# Altium schematic sheet ProtectionChannelD.SchDoc
size 420 x 297 mm; Address1: Address1; Address2: Address2; Address3: Address3; Address4: Address4; DocumentNumber: АБВГ.123456.001 Э3; SheetNumber: 5; SheetTotal: 7; Scale: 1:1; DocumentType: Схема электрическая принципиальная; FirstReferrence: АБВГ.123456.001
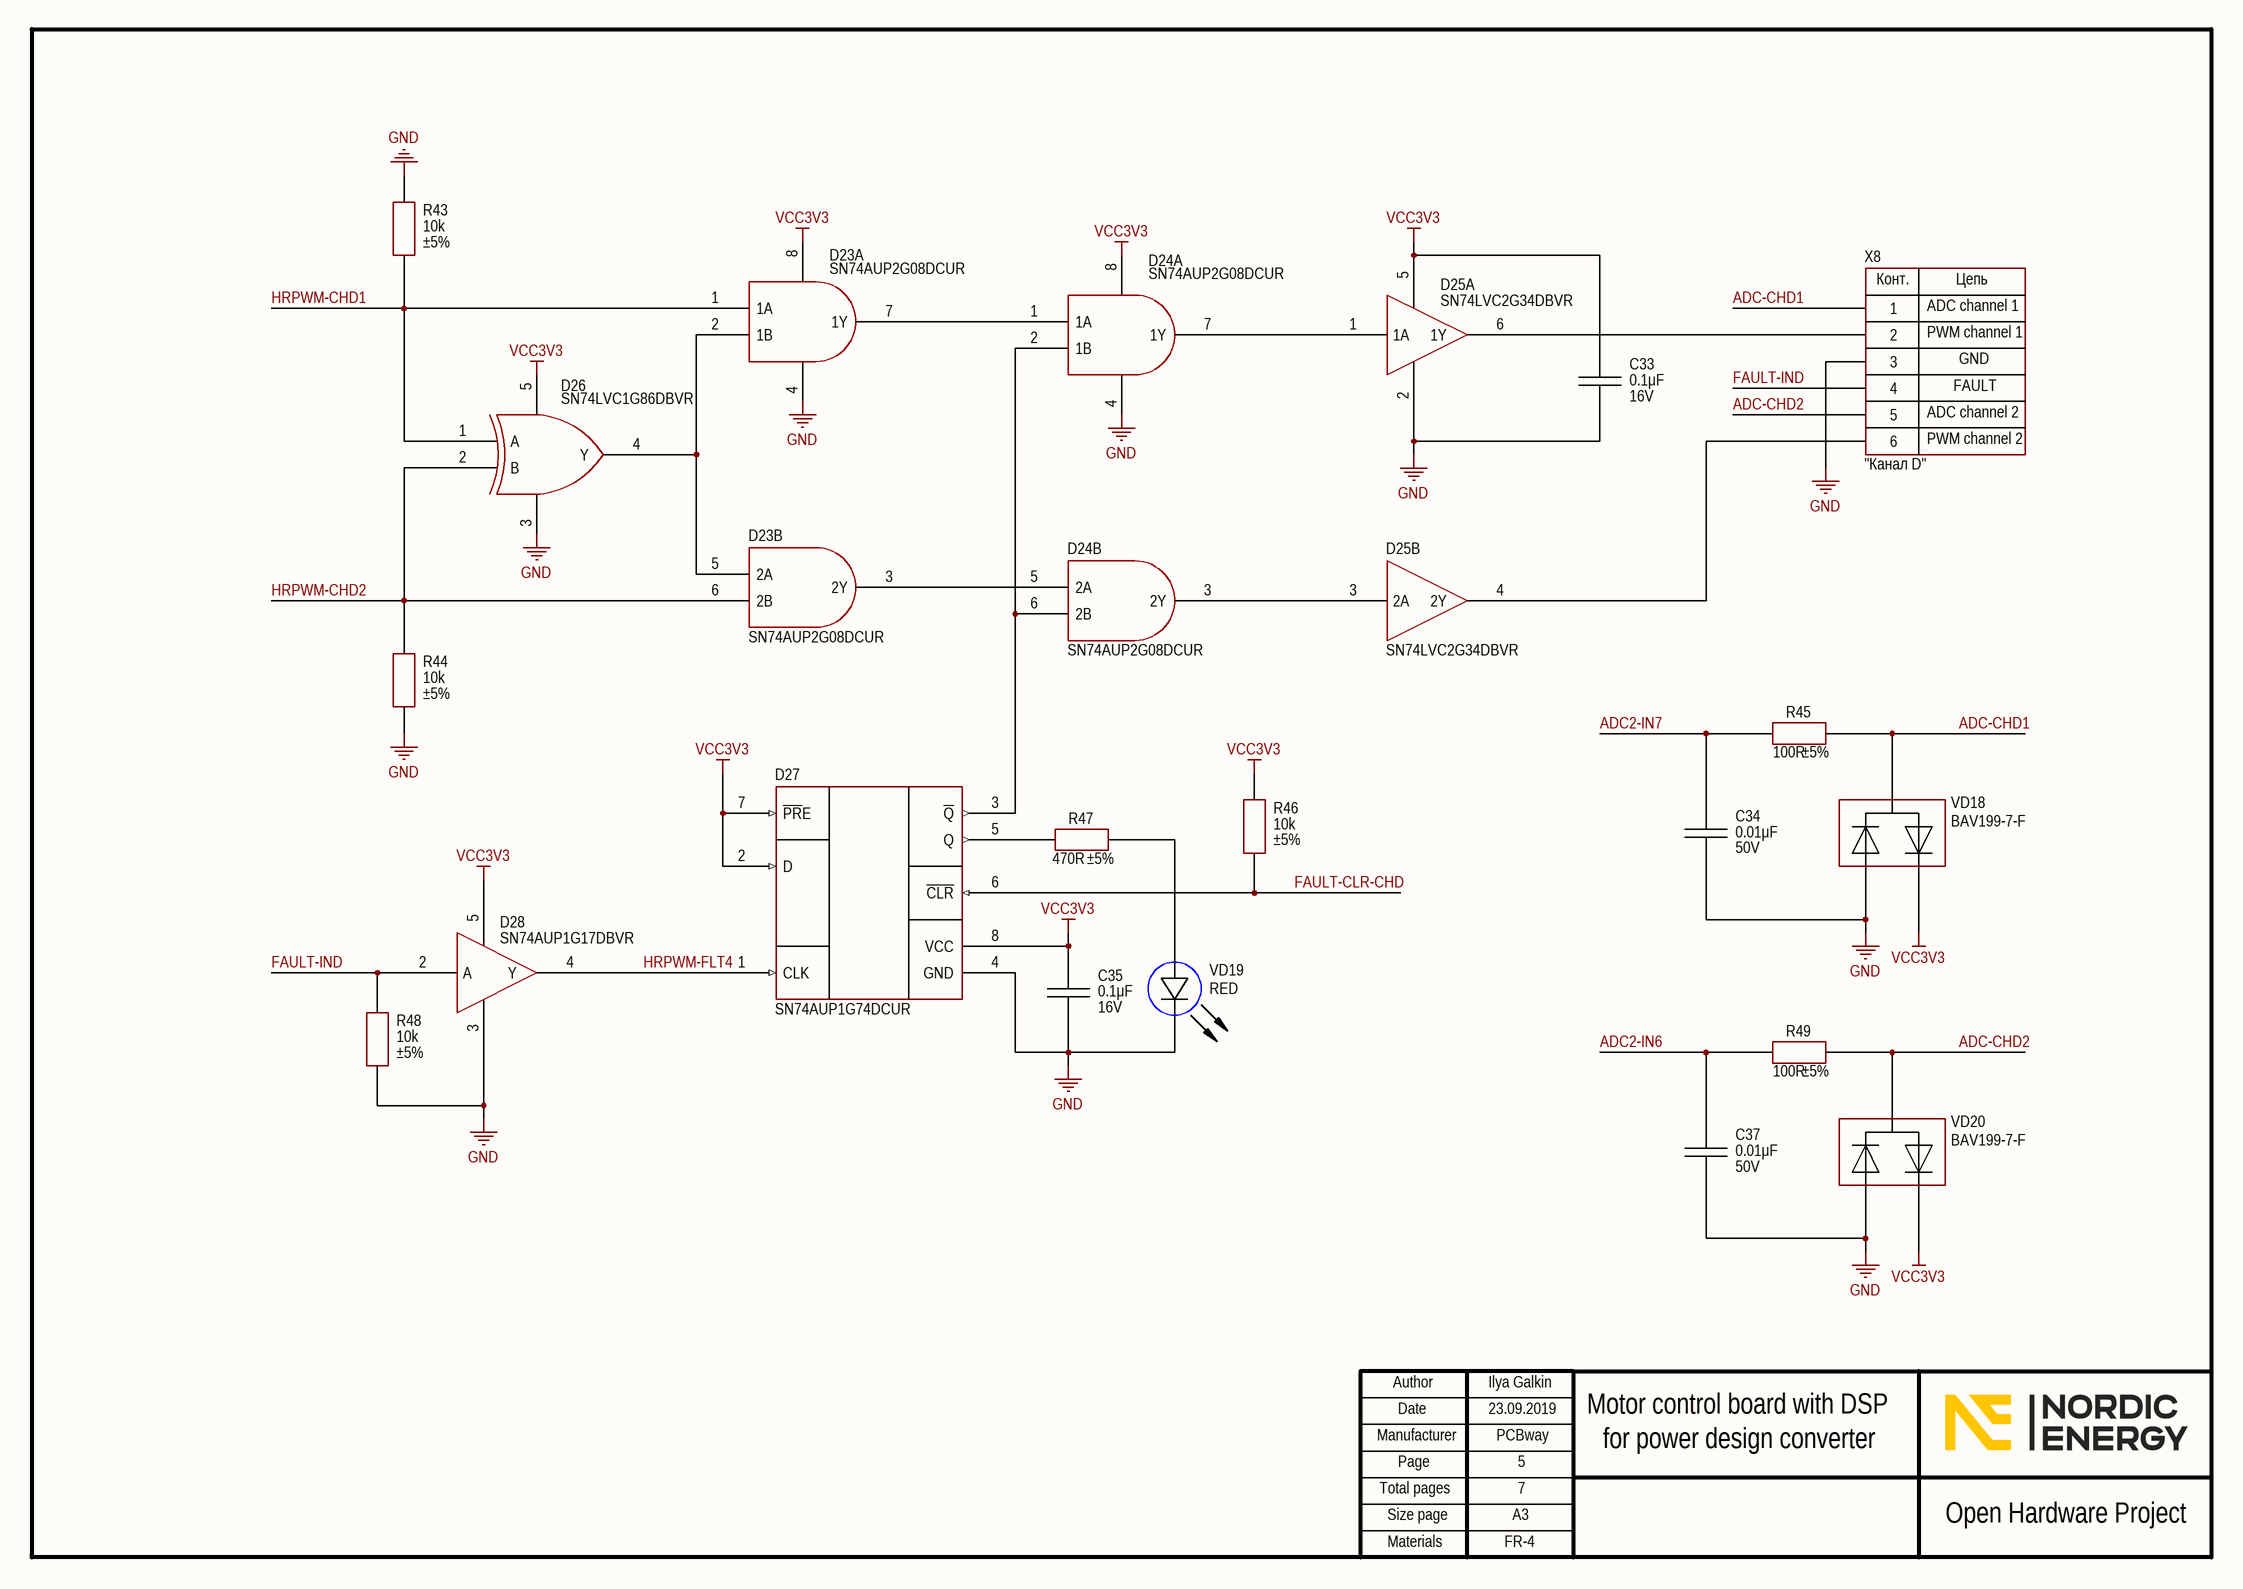
[diagram p0: ProtectionChannelD.SchDoc]

## Parts
C33  value 0.1μF  Voltage: 16V  [CAP: 0805]
C34  value 0.01μF  Voltage: 50V  [CAP: 0805]
C35  value 0.1μF  Voltage: 16V  [CAP: 0805]
C37  value 0.01μF  Voltage: 50V  [CAP: 0805]
D23  (no value)  [8-VSSOP]  (parts A,B of 2)
D24  (no value)  [8-VSSOP]  (parts A,B of 2)
D25  (no value)  [SOT23-6]  (parts A,B of 2)
D26  (no value)  [SOT23-5]
D27  (no value)  [8-VSSOP]
D28  (no value)  [SOT23-5]
R43  value 10k  Tolerance: ±5%  [RES: 0805]
R44  value 10k  Tolerance: ±5%  [RES: 0805]
R45  value 100R  Tolerance: ±5%  [RES: 0805]
R46  value 10k  Tolerance: ±5%  [RES: 0805]
R47  value 470R  Tolerance: ±5%  [RES: 0805]
R48  value 10k  Tolerance: ±5%  [RES: 0805]
R49  value 100R  Tolerance: ±5%  [RES: 0805]
VD18  PartNumber: BAV199-7-F  [SOT23]
VD19  Color: RED  [LED: 0805R]
VD20  PartNumber: BAV199-7-F  [SOT23]
X8  CommentText: "Канал D"  [CON: PLD-6]

## Nets
GND: C33.1 C34.1 C35.1 C37.1 D23.4 D24.4 D25.2 D26.3 D27.4(GND) D28.3 R43.1 R44.2 R48.2 VD18.1 VD19.2(C) VD20.1 X8.3
VCC3V3: C33.2 C35.2 D23.8 D24.8 D25.5 D26.5 D27.2(D) D27.7(~{PR}E) D27.8(VCC) D28.5 R46.1 VD18.2 VD20.2
ADC2-IN6: C37.2 R49.1
ADC2-IN7: C34.2 R45.1
ADC-CHD1: R45.2 VD18.3 X8.1
ADC-CHD2: R49.2 VD20.3 X8.5
FAULT-CLR-CHD: D27.6(~{CLR}) R46.2
FAULT-IND: D28.2(A) R48.1 X8.4
HRPWM-CHD1: D23.1(1A) D26.1(A) R43.2
HRPWM-CHD2: D23.6(2B) D26.2(B) R44.1
HRPWM-FLT4: D27.1(CLK) D28.4(Y)
NetD23_2: D23.2(1B) D23.5(2A) D26.4(Y)
NetD23_3: D23.3(2Y) D24.5(2A)
NetD23_7: D23.7(1Y) D24.1(1A)
NetD24_2: D24.2(1B) D24.6(2B) D27.3(~{Q})
NetD24_3: D24.3(2Y) D25.3(2A)
NetD24_7: D24.7(1Y) D25.1(1A)
NetD25_4: D25.4(2Y) X8.6
NetD25_6: D25.6(1Y) X8.2
NetD27_5: D27.5(Q) R47.2
NetR47_1: R47.1 VD19.1(A)

## Notes on the sheet
- ADC channel 1
- PWM channel 1
- FAULT
- GND
- ADC channel 2
- PWM channel 2
- Ilya Galkin
- 23.09.2019
- PCBway
- 5
- Motor control board with DSP
- for power design converter
- 7
- FR-4
- Author
- Manufacturer
- Date
- Page
- Total pages
- Size page
- A3
- Open Hardware Project
- Materials
- (in symbol PLD-6) Конт.; Цепь

## Library data of the parts
C33 C35 = Ceramic_0805: Manufacturer: Yageo; PartNumber: CC0805KRX7R7BB104; ValueManufacturerPartNumber: Ceramic capacitor, 0.1μF, X7R, ±10%, 16V, 0805, -55...+125°C; TypeCapacitor: Ceramic capacitor; Tolerance: ±10%; TypeDielectric: X7R; Package: 0805; HelpURL: https://www.digikey.com/product-detail/en/yageo/CC0805KRX7R7BB104/311-1142-1-ND/303052; Temperature: -55...+125°C
C34 C37 = Ceramic_0805: Manufacturer: Yageo; PartNumber: CC0805KRX7R9BB103; ValueManufacturerPartNumber: Ceramic capacitor, 0.01μF, X7R, ±10%, 50V, 0805, -55...+125°C; TypeCapacitor: Ceramic capacitor; Tolerance: ±10%; TypeDielectric: X7R; Package: 0805; HelpURL: https://www.digikey.com/product-detail/en/yageo/CC0805KRX7R9BB103/311-1136-1-ND/303046; Temperature: -55...+125°C
D23 D24 = SN74AUP2G08DCUR: AND; Manufacturer: Texas Instruments; ValueManufacturerPartNumber: IC logic AND, 0.8...3.6V, -40...+855°C, 8-VSSOP; Supply: 0.8...3.6V; HelpURL: https://www.digikey.com/product-detail/en/texas-instruments/SN74AUP2G08DCUR/296-32271-1-ND/3505517; Package: 8-VSSOP; ComponentType: IC logic AND; Temperature: -40...+855°C; PartNumber: SN74AUP2G08DCUR
D25 = SN74LVC2G34DBVR: Buffer; Manufacturer: Texas Instruments; ValueManufacturerPartNumber: IC logic buffer, 1.65...5.5V, -40...+125°C, SOT23-6; Supply: 1.65...5.5V; HelpURL: https://www.digikey.com/product-detail/en/texas-instruments/SN74LVC2G34DBVR/296-13496-1-ND/486431; Package: SOT23-6; ComponentType: IC logic buffer; Temperature: -40...+125°C; PartNumber: SN74LVC2G34DBVR
D26 = SN74LVC1G86DBVR: XOR; Manufacturer: Texas Instruments; ValueManufacturerPartNumber: IC logic XOR, 1.65...5.5V, -40...+125°C, SOT23-5; Supply: 1.65...5.5V; HelpURL: https://www.digikey.com/product-detail/en/texas-instruments/SN74LVC1G86DBVR/296-9853-1-ND/380077; Package: SOT23-5; ComponentType: IC logic XOR; Temperature: -40...+125°C; PartNumber: SN74LVC1G86DBVR
D27 = SN74AUP1G74DCUR: D-trigger; Manufacturer: Texas Instruments; ValueManufacturerPartNumber: ICtrigger D-type, 0.8...3.6V, -40...+85°C, 8-VSSOP; Supply: 0.8...3.6V; HelpURL: https://www.digikey.com/product-detail/en/texas-instruments/SN74AUP1G74DCUR/296-19761-1-ND/1091423; Package: 8-VSSOP; ComponentType: ICtrigger D-type; Temperature: -40...+85°C; PartNumber: SN74AUP1G74DCUR
D28 = SN74AUP1G17DBVR: Schmitt trigger; Manufacturer: Texas Instruments; ValueManufacturerPartNumber: IC Schmitt trigger, 0.8...3.6V, -40...+85°C, SOT23-6; Supply: 0.8...3.6V; HelpURL: https://www.digikey.com/product-detail/en/texas-instruments/SN74AUP1G17DBVR/296-19077-1-ND/864308; Package: SOT23-6; ComponentType: IC Schmitt trigger; Temperature: -40...+85°C; PartNumber: SN74AUP1G17DBVR
R43 R44 R46 R48 = Resistor_0805: Manufacturer: Yageo; PartNumber: RC0805JR-0710KL; ValueManufacturerPartNumber: Resistor film, 10k, ±5%, 0805, 0.125W, -55...+125°C; TypeResistor: Resistor film; Power: 0.125W; Package: 0805; HelpURL: https://www.digikey.com/product-detail/en/yageo/RC0805JR-0710KL/311-10KARCT-ND/731188; Temperature: -55...+125°C
R45 R49 = Resistor_0805: Manufacturer: Yageo; PartNumber: RC0805JR-07100RL; ValueManufacturerPartNumber: Resistor film, 100R, ±5%, 0805, 0.125W, -55...+125°C; TypeResistor: Resistor film; Power: 0.125W; Package: 0805; HelpURL: https://www.digikey.com/product-detail/en/yageo/RC0805JR-07100RL/311-100ARCT-ND/731185; Temperature: -55...+125°C
R47 = Resistor_0805: Manufacturer: Yageo; PartNumber: RC0805JR-07470RL; ValueManufacturerPartNumber: Resistor film, 470R, ±5%, 0805, 0.125W, -55...+125°C; TypeResistor: Resistor film; Power: 0.125W; Package: 0805; HelpURL: https://www.digikey.com/product-detail/en/yageo/RC0805JR-07470RL/311-470ARCT-ND/731280; Temperature: -55...+125°C
VD18 VD20 = Diode_array: Manufacturer: Diodes Incorporated; ValueManufacturerPartNumber: Diode array, 85V, 140mA, 1.1V, 3us, SOT-23, -65...+150°C; TypeDiode: Diode array; Voltage: 85V; Current: 140mA; VoltageDrop: 1.1V; RecoveryTime: 3us; Package: SOT-23; HelpURL: https://www.digikey.com/product-detail/en/diodes-incorporated/BAV199-7-F/BAV199-FDICT-ND/1033647; Temperature: -65...+150°C
VD19 = LED_single: Manufacturer: Wurth; ValueManufacturerPartNumber: LED, 20mA, 2V, 0805, -55...+150°C; PartNumber: 150080RS75000; TypeDiode: LED; Current: 20mA; VoltageDrop: 2V; Package: 0805; HelpURL: https://www.digikey.com/product-detail/en/wurth-electronics-inc/150080RS75000/732-4984-1-ND/4489916; Temperature: -55...+150°C
X8 = PLD-6: Manufacturer: Connfly; ValueManufacturerPartNumber: Connector, 6pin, 2.54mm, 500VAC, 3A; TypeConnector: Connector; VoltageMax: 500VAC; Pitch: 2.54mm; CurrentMax: 3A; Multichannel: 6pin; HelpURL: https://www.chipdip.ru/product/pld-6; PartNumber: PLD-6